# Altium schematic sheet USB.SchDoc: USB
size A4; SheetNumber: 5; SheetTotal: 13
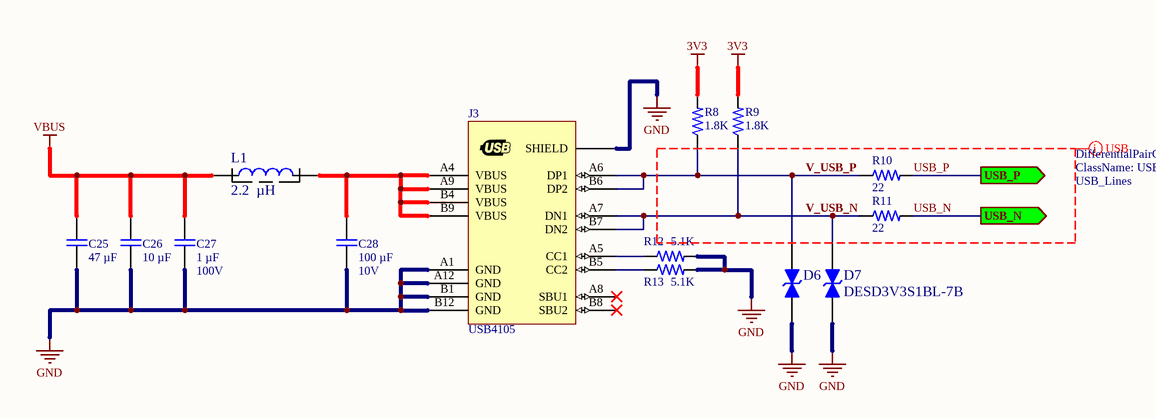
[diagram p0: USB.SchDoc]

## Parts
C25  47 µF  [MergenElektronik_Capacitors_Ceramics_SMDs_1206_M_NS]
C26  10 µF  [MergenElektronik_Capacitors_Ceramics_SMDs_0603_M_NS]
C27  1 µF  Voltage Rating: 100V  [MergenElektronik_Capacitors_Ceramics_SMDs_1206_M_NS]
C28  100 µF  Voltage Rating: 10V  [MergenElektronik_Capacitors_Ceramics_SMDs_1210_M_NS]
D6  DESD3V3S1BL-7B  [MergenElektronik_Diodes_TVSDiodes_0402_L]  (value not drawn)
D7  DESD3V3S1BL-7B  [MergenElektronik_Diodes_TVSDiodes_0402_L]
J3  USB4105  [MergenElektronik_Connectors_USB_USB4105]
L1  2.2  µH  [MergenElektronik_Inductors_PowerInductors_SMDs_1008_M_NS]
R8  1.8K  [MergenElektronik_Resistors_ChipResistors_0603_M_NS]
R9  1.8K  [MergenElektronik_Resistors_ChipResistors_0603_M_NS]
R10  22  [MergenElektronik_Resistors_ChipResistors_0603_M_NS]
R11  22  [MergenElektronik_Resistors_ChipResistors_0603_M_NS]
R12  5.1K  [MergenElektronik_Resistors_ChipResistors_0603_M_NS]
R13  5.1K  [MergenElektronik_Resistors_ChipResistors_0603_M_NS]

## Ports
USB_N (out, see Microcontroller[3C]), USB_P (out, see Microcontroller[3C])

## Nets
3V3: R8.2 R9.2
GND: C25.2 C26.2 C27.2 C28.2 D6.1(ANOT) D7.1(ANOT) J3.A1(GND) J3.A12(GND) J3.B1(GND) J3.B12(GND) J3.SHIELD R12.2 R13.2
VBUS: C25.1 C26.1 C27.1 L1.1
USB_N: R11.2 ; port USB_N
USB_P: R10.2 ; port USB_P
V_USB_N: D7.2(KATOT) J3.A7(DN1) J3.B7(DN2) R9.1 R11.1
V_USB_P: D6.2(KATOT) J3.A6(DP1) J3.B6(DP2) R8.1 R10.1
NetC28_1: C28.1 J3.A4(VBUS) J3.A9(VBUS) J3.B4(VBUS) J3.B9(VBUS) L1.2
NetJ3_A5: J3.A5(CC1) R12.1
NetJ3_B5: J3.B5(CC2) R13.1

Not connected (* = marked no-connect by the designer): J3 A8(SBU1)* B8(SBU2)*

## Layout directives
differential pair; differential pair class USB_Lines; net class USB; differential pair class USB_Lines: USB_N, USB_P, V_USB_N, V_USB_P

## Notes on the sheet
- Title:
- Size:
- Date:
- A4
- Number:
- Time:
- Revision:
- Sheet
- of
- Project
- Drawn By :

## Library data of the parts
C25 = MergenElektronik_Capacitors_Ceramic_SMDs_47µF_25V: Mergen Elektronik - Capacitors - Ceramics - SMDs - 1206 - 47 µF - 25V; Manufacturer: TDK Corporation; Manufacturer Number: C3216X5R1E476M160AC; Model: Ceramic Capacitors; Tolerance: ±20%; Value: 47 µF; Temperature: -55°C up to +85°C; Digi-Key Number: 445-8047-2-ND; Package: 1206(3216); Mouser Number: 810-C3216X5R1E476M; Mounting Type: Surface Mount; Supplier 1: Digi-Key; Supplier 2: Mouser; Supplier Part Number 1: 445-8047-2-ND; Supplier Part Number 2: 810-C3216X5R1E476M; Özdisan Number: C3216X5R1E476M160AC; Farnell Number: 2525172; Voltage Rating: 25V
C26 = MergenElektronik_Capacitors_Ceramic_SMDs_10µF_25V: Mergen Elektronik - Capacitors - Ceramics - SMDs - 0603 - 10 µF - 25V; Manufacturer: Murata Electronics; Manufacturer Number: GRT188R61E106ME13D; Model: Ceramic Capacitors; Tolerance: ±20%; Value: 10 µF; Temperature: -55°C up to +85°C; Digi-Key Number: 490-12323-1-ND; Package: 0603(1608); Farnell Number: 3581819; Mouser Number: 81-GRT188R61E106ME3D; Mounting Type: Surface Mount; Supplier 1: Digi-Key; Supplier 2: Mouser; Supplier Part Number 1: 490-12323-1-ND; Supplier Part Number 2: 81-GRT188R61E106ME3D; Voltage Rating: 25V
C27 = MergenElektronik_Capacitors_Ceramic_SMDs_1µF_100V: Mergen Elektronik - Capacitors - Ceramics - SMDs - 1206 - 1 µF - 100V; Manufacturer: Samsung Electro-Mechanics; Manufacturer Number: CL31B105KCHNNNE; Model: Ceramic Capacitors; Tolerance: ±10%; Value: 1 µF; Temperature: -55°C up to +125°C; Digi-Key Number: 1276-1838-1-ND; Package: 1206(3216 Metric); Mouser Number: 187-CL31B105KCHNNNE; Mounting Type: Surface Mount; Özdisan Number: CL31B105KCHNNNE; Supplier 1: Digikey; Supplier 2: Mouser; Supplier Part Number 1: 1276-1838-1-ND; Supplier Part Number 2: 187-CL31B105KCHNNNE
C28 = MergenElektronik_Capacitors_Ceramic_SMDs_100µF_10V: Mergen Elektronik - Capacitors - Ceramics - SMDs - 1210 - 100 µF - 10V; Manufacturer: Samsung Electro-Mechanics; Manufacturer Number: CL32A107MPVNNNE; Model: Ceramic Capacitors; Tolerance: ±20%; Özdisan Number: CL10B104KO8NNNC; Value: 100 µF; Temperature: -55°C up to +85°C; Digi-Key Number: 1276-3364-1-ND; Package: 1210(3225 Metric); Mouser Number: 187-CL32A107MPVNNNE; Mounting Type: Surface Mount; Farnell Number: 1838744; Supplier 1: Mouser; Supplier 2: Digi-Key; Supplier Part Number 1: 187-CL10B104KO8NNNC; Supplier Part Number 2: 1276-1005-6-ND
D6 D7 = MergenElektronik_Diodes_TVSDiodes_DESD3V3S1BL-7B: Mergen Elektronik - Diodes - TVS Diodes - DESD3V3S1BL-7B; Manufacturer: Diodes Incorporated; Breakdown Voltage: 3.8V; Current - Peak Pulse: 5A(8/20µs); Voltage Reverse Standoff: 3.3V(Max); Capacitance @ Frequency: 10pF @ 1MHz; Voltae Clamping: 7V; Digi-Key Number: DESD3V3S1BL-7BDITR-ND; Manufacturer Number: DESD3V3S1BL-7B; Model: TVS Diodes; Mounting Type: Surface Mount; Package: 0402 (1006 Metric); Temperature: -65°C up to +150°C; Value: DESD3V3S1BL-7B; Mouser Number: 621-DESD3V3S1BL-7B; Farnell Number: 3127287; Supplier 1: Digikey; Supplier 2: Mouser; Supplier Part Number 2: DESD3V3S1BL-7BDITR-ND; Supplier Part Number 1: 621-DESD3V3S1BL-7B
J3 = MergenElektronik_Connectors_USB_USB4105: Mergen Elektronik - Connectors - USB Connectors - USB4105; Manufacturer: GCT; Manufacturer Number: USB4105-GF-A; Model: Type - C / USB 2.0; Current Rating: 0.25A, 1.25A, 5A, 6.25A; Voltage Rating: 20VDC; Value: USB4105; Mounting Type: THT - SMD R/A; Temperature: -40°C up to 85°C; Digi-Key Number: 2073-USB4105-GF-ACT-ND; Mouser Number: 640-USB4105-GF-A; Farnell Number: 3588205; Özdisan Number: USB4105-GF-A; Supplier 1: Digi-Key; Supplier Part Number 1: 2073-USB4105-GF-ADKR-ND; Supplier 2: Mouser; Supplier Part Number 2: 640-USB4105-GF-A; Package: USB4105
L1 = MergenElektronik_Inductors_PowerInductors_SMDs_1008_2.2µH-2A: Mergen Elektronik - Inductors - Power Inductors - SMDs - 1008 - 2.2 µh - 2A; Manufacturer: Samsung Electro-Mechanics; Manufacturer Number: CIGT252008LM2R2MNE; Digi-Key Number: 1276-6925-1-ND; Model: Power Inductor; Mounting Type: Surface Mount; Package: 1008 (2520 Metric); Temperature: -40°C up to  125°C; Value: 2.2  µH; Current Rating: 2A; Mouser Number: 187-CIGT252008LM2R2M; Supplier 1: Digi-Key; Supplier 2: Mouser; Supplier Part Number 1: 1276-6925-6-ND; Supplier Part Number 2: 187-CIGT252008LM2R2M
R8 R9 = MergenElektronik_Resistors_ChipResistors_0603_1.8K: Mergen Elektronik - Resistors - Chip Resistors - 0603 - 1.8K; Manufacturer: Stackpole Electronics Inc; Manufacturer Number: RMCF0603JT1K80; Value: Chip Resistor - 0603 - 1.8K; Power: 1/10W; Tolerance: ±5%; Package: 0603(1608); Temperature: -55°C up to +155°C - X8R; Model: Chip Resistor; Digi-Key Number: RMCF0603JT1K80TR-ND; Mounting Type: Surface Mount; Mouser Number: 708-RMCF0603JT1K80; Supplier 1: Digikey; Supplier 2: Mouser; Supplier Part Number 1: RMCF0603JT1K80TR-ND; Supplier Part Number 2: 708-RMCF0603JT1K80
R10 R11 = MergenElektronik_Resistors_ChipResistors_0603_22: Mergen Elektronik - Resistors - Chip Resistors - 0603 - 22; Manufacturer: TE Connectivity Passive Product; Manufacturer Number: CRGCQ0603J22R; Value: Chip Resistor - 0603 - 22; Power: 1/10W; Tolerance: ±5%; Özdisan Number: RMCF0603ZT0R00; Package: 0603(1608); Temperature: -55°C up to +155°C - X8R; Model: Chip Resistor; Digi-Key Number: A130081CT-ND; Mounting Type: Surface Mount; Mouser Number: 279-CRGCQ0603J22R; Farnell Number: 2861854; Supplier 1: Digi-Key; Supplier 2: Mouser; Supplier Part Number 1: A130081CT-ND; Supplier Part Number 2: 279-CRGCQ0603J22R
R12 R13 = MergenElektronik_Resistors_ChipResistors_0603_5.1K: Mergen Elektronik - Resistors - Chip Resistors - 0603 - 5.1K; Manufacturer: Stackpole Electronics Inc; Manufacturer Number: RMCF0603JT5K10; Value: Chip Resistor - 0603 - 5.1K; Power: 1/10W; Tolerance: ±5%; Package: 0603(1608); Temperature: -55°C up to +155°C - X8R; Model: Chip Resistor; Digi-Key Number: RMCF0603JT5K10CT-ND; Mounting Type: Surface Mount; Mouser Number: 708-RMCF0603JT5K10; Supplier 1: Digi-Key; Supplier Part Number 1: RMCF0603JT5K10DKR-ND